# Altium schematic sheet Connectors.SchDoc
size A4; SheetNumber: 4; SheetTotal: 5
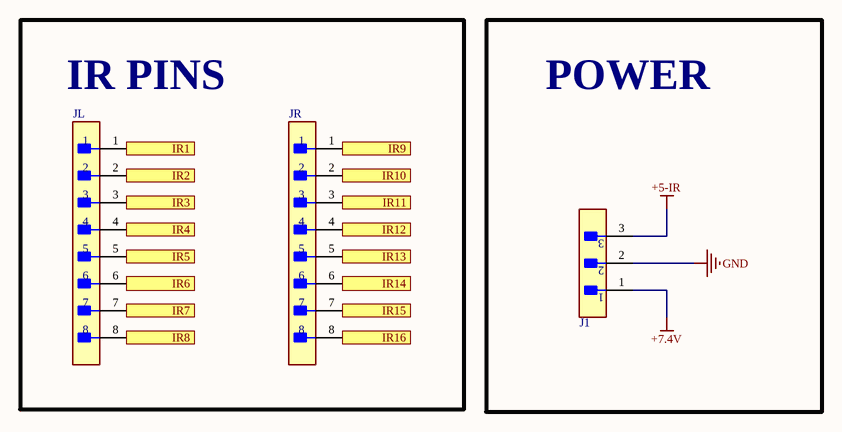
[diagram p0: Connectors.SchDoc]

## Parts
J1  22-29-2031  [FP-22-29-2031-MFG]  (value not drawn)
JL  22-29-2081  [FP-22-29-2081-MFG]  (value not drawn)
JR  22-29-2081  [FP-22-29-2081-MFG]  (value not drawn)

## Blocks framed on the sheet
IR PINS: JL JR
POWER: J1

## Ports
IR1 (in, see Main[3B], IR_array[1A]), IR2 (in, see Main[3B], IR_array[2A]), IR3 (in, see Main[3B], IR_array[3A]), IR4 (in, see Main[3B], IR_array[3A]), IR5 (in, see Main[3B], IR_array[1B]), IR6 (in, see Main[3B], IR_array[2B]), IR7 (in, see Main[3B], IR_array[3B]), IR8 (in, see Main[3B], IR_array[3B]), IR9 (in, see Main[3B], IR_array[1C]), IR10 (in, see Main[3B], IR_array[2C]), IR11 (in, see Main[3B], IR_array[3C]), IR12 (in, see Main[3B], IR_array[3C]), IR13 (in, see Main[3B], IR_array[1D]), IR14 (in, see Main[3B], IR_array[2D]), IR15 (in, see Main[3B], IR_array[3D]), IR16 (in, see Main[3C], IR_array[3D])

## Nets
+5-IR: J1.3
+7.4V: J1.1
GND: J1.2
IR1: JL.1 ; port IR1
IR2: JL.2 ; port IR2
IR3: JL.3 ; port IR3
IR4: JL.4 ; port IR4
IR5: JL.5 ; port IR5
IR6: JL.6 ; port IR6
IR7: JL.7 ; port IR7
IR8: JL.8 ; port IR8
IR9: JR.1 ; port IR9
IR10: JR.2 ; port IR10
IR11: JR.3 ; port IR11
IR12: JR.4 ; port IR12
IR13: JR.5 ; port IR13
IR14: JR.6 ; port IR14
IR15: JR.7 ; port IR15
IR16: JR.8 ; port IR16

## Notes on the sheet
- Title:
- Auther:
- L.H.H.Maduwantha
- Size:
- A4
- Date:
- File:
- Time:
- Sheet
- Of

## Library data of the parts
J1 = CMP-04776-000327-1: CONN HEADER VERT 3POS 2.54MM; Contact Resistance: 10mR; Number of Positions: 3; Voltage Rating: 250V; Gender: Male; Connector Type: Male Pin; Current Rating: 4A; Packaging: Bulk; Housing Material: Nylon; Min Operating Temperature: 0°C; Color: Natural; RoHS Compliant: Yes; Housing Color: White; Number of Rows: 1; Pitch: 2.54mm; Mount: Through Hole; Fastening Type: Friction; Length: 7.62mm; Depth: 5.8mm; Contact Material: Brass; Max Operating Temperature: 75°C; Number of Contacts: 3; Contact Type: Male Pin; Working Voltage: 250V; Orientation: Straight; Lead Pitch: 2.54mm; Radiation Hardening: No; Termination: Solder; Contact Plating: Gold; Contact Mating Length: 0.295inch; Series: KK® 6410
JL JR = CMP-00257-00277737-1: 22-29-2081 KK® 254 Wire-to-Board Header, Vertical, with Friction Lock, 8 Circuits, Gold (Au) Plating; NexarPartId: 277737; Contact Resistance: 10mΩ; Voltage Rating: 250V; Number of Positions: 8; Pitch: 2.54mm; Insulation Resistance: 50GΩ; Glow Wire Compliant: Non-compliant; Gender: Male; Current Rating: 4A; Number of Pins: 8; Lead Free: Lead Free; Color: White; Flammability Rating: UL94 V-0; REACH SVHC: Unknown; Height: 11.42mm; Housing Material: Nylon; Contact Plating: Gold; Packaging: Bulk; Min Operating Temperature: -40°C; Number of Contacts: 8; Voltage Rating (DC): 250V; Termination: Through Hole; Number of Rows: 1; Halogen Free: Low Halogen; Contact Material: Brass; Radiation Hardening: No; Max Operating Temperature: 75°C; Orientation: Vertical; Mount: Through Hole; Schedule B: 8536694040; Number of Circuits: 8; RoHS: Compliant; Lead Pitch: 2.54mm